# Altium schematic sheet Schema_linksonder.SchDoc
size A4; SheetNumber: 2; SheetTotal: 2
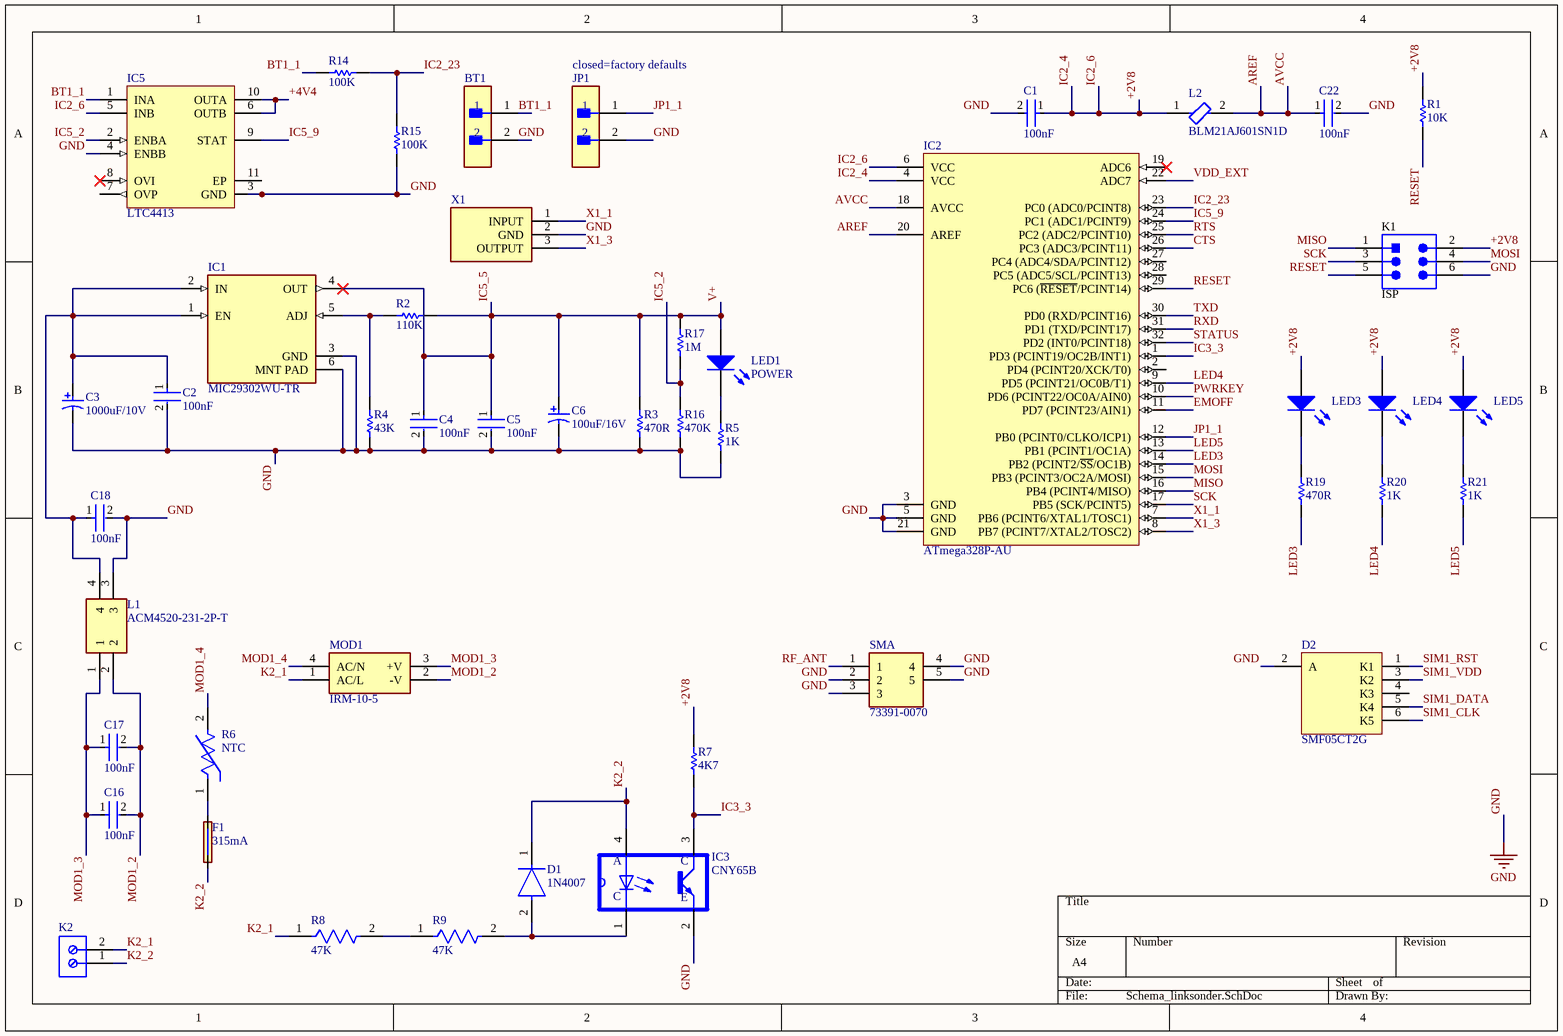
[diagram p0: Schema_linksonder.SchDoc]

## Parts
BT1  (no value)  [FP-M20-9990246-MFG]
C1  100nF  [FP-CC1206-1_25-MFG]
C2  100nF  [FP-CC1206-1_25-MFG]
C3  1000uF/10V  [NIC-CAPA2-10X10_V]
C4  100nF  [FP-CC1206-1_25-MFG]
C5  100nF  [FP-CC1206-1_25-MFG]
C6  100uF/16V  [AVX-TAJ-C-2_M]
C16  100nF  [FP-CC1206-1_25-MFG]
C17  100nF  [FP-CC1206-1_25-MFG]
C18  100nF  [FP-CC1206-1_25-MFG]
C22  100nF  [FP-CC1206-1_25-MFG]
D1  1N4007  [FP-1N4007-MFG]
D2  SMF05CT2G  [ONSC-SC70-6-419B-02_W_V]
F1  315mA  [MC000827]
IC1  MIC29302WU-TR  [FP-C04-012-MFG]
IC2  ATmega328P-AU  [32A_M]
IC3  CNY65B  [DIP762W50P1524L1780H610Q4]
IC5  LTC4413  [LT-DD-10_V]
JP1  closed=factory defaults  [FP-M20-9990246-MFG]
K1  ISP  [SMTC-TSW-103-08-L-D_V]
K2  (no value)  [PHOE-1714955_V]
L1  ACM4520-231-2P-T  [ACM4520]
L2  BLM21AJ601SN1D  [FP-BLM21-0_2-t0_85-e0_5-MFG]
LED1  POWER  [1206_A]
LED3  (no value)  [1206_A]
LED4  (no value)  [1206_A]
LED5  (no value)  [1206_A]
MOD1  IRM-10-5  [IRM-10]
R1  10K  [RESC3225X70X50NL20T20]
R2  110K  [RESC3225X70X50NL20T20]
R3  470R  [RESC3225X70X50NL20T20]
R4  43K  [RESC3225X70X50NL20T20]
R5  1K  [RESC3225X70X50NL20T20]
R6  NTC  [FP-NTPAA-MFG]
R7  4K7  [RESC3225X70X50NL20T20]
R8  47K  [FP-MRS25-MFG]
R9  47K  [FP-MRS25-MFG]
R14  100K  [RESC3225X70X50NL20T20]
R15  100K  [RESC3225X70X50NL20T20]
R16  470K  [RESC3225X70X50NL20T20]
R17  1M  [RESC3225X70X50NL20T20]
R19  470R  [RESC3225X70X50NL20T20]
R20  1K  [RESC3225X70X50NL20T20]
R21  1K  [RESC3225X70X50NL20T20]
SMA  73391-0070  [733910070]
X1  (no value)  [CSTCC8M00G53R0]

## Nets
GND: BT1.2 C1.2 C2.2 C3.2 C4.2 C5.2 C6.2 C18.2 C22.2 D2.2(A) IC1.3(GND) IC1.6(MNT_PAD) IC2.3(GND) IC2.5(GND) IC2.21(GND) IC3.2(E) IC5.3(GND) IC5.4(ENBB) JP1.2 K1.6 L1.3 R3.1 R4.1 R5.1 R15.1 R16.1 SMA.2 SMA.3 SMA.4 SMA.5 X1.2(GND)
+2V8: C1.1 IC2.4(VCC) IC2.6(VCC) IC5.5(INB) K1.2 L2.1 LED3.2(A) LED4.2(A) LED5.2(A) R1.2 R7.2  [also labelled IC2_4, IC2_6]
+4V4: IC5.6(OUTB) IC5.10(OUTA)
AREF: C22.1 IC2.18(AVCC) IC2.20(AREF) L2.2  [also labelled AVCC]
BT1_1: BT1.1 IC5.1(INA) R14.1
CTS: IC2.26(PC3_(ADC3/PCINT11))
EMOFF: IC2.11(PD7_(PCINT23/AIN1))
IC2_23: IC2.23(PC0_(ADC0/PCINT8)) R14.2 R15.2
IC3_3: IC2.1(PD3_(PCINT19/OC2B/INT1)) IC3.3(C`) R7.1
IC5_2: IC5.2(ENBA) R16.2 R17.1
IC5_5: C4.1 C5.1 C6.1 IC1.4(OUT) LED1.2(A) R2.1 R3.2 R17.2  [also labelled V+]
IC5_9: IC2.24(PC1_(ADC1/PCINT9)) IC5.9(STAT)
JP1_1: IC2.12(PB0_(PCINT0/CLKO/ICP1)) JP1.1
K2_1: K2.2 MOD1.1(AC/L) R8.1
K2_2: D1.1(C) F1.P$2 IC3.4(A) K2.1
LED3: IC2.14(PB2_(PCINT2/~{SS}/OC1B)) R19.1
LED4: IC2.9(PD5_(PCINT21/OC0B/T1)) R20.1
LED5: IC2.13(PB1_(PCINT1/OC1A)) R21.1
MISO: IC2.16(PB4_(PCINT4/MISO)) K1.1
MOD1_2: C16.2 C17.2 L1.2 MOD1.2(-V)
MOD1_3: C16.1 C17.1 L1.1 MOD1.3(+V)
MOD1_4: MOD1.4(AC/N) R6.2
MOSI: IC2.15(PB3_(PCINT3/OC2A/MOSI)) K1.4
PWRKEY: IC2.10(PD6_(PCINT22/OC0A/AIN0))
RESET: IC2.29(PC6_(~{RESET}/PCINT14)) K1.5 R1.1
RF_ANT: SMA.1
RTS: IC2.25(PC2_(ADC2/PCINT10))
RXD: IC2.31(PD1_(TXD/PCINT17))
SCK: IC2.17(PB5_(SCK/PCINT5)) K1.3
SIM1_CLK: D2.6(K5)
SIM1_DATA: D2.5(K4)
SIM1_RST: D2.1(K1)
SIM1_VDD: D2.3(K2)
STATUS: IC2.32(PD2_(INT0/PCINT18))
TXD: IC2.30(PD0_(RXD/PCINT16))
VDD_EXT: IC2.22(ADC7)
X1_1: IC2.7(PB6_(PCINT6/XTAL1/TOSC1)) X1.1(INPUT)
X1_3: IC2.8(PB7_(PCINT7/XTAL2/TOSC2)) X1.3(OUTPUT)
NetC2_1: C2.1 C3.1 C18.1 IC1.1(EN) IC1.2(IN) L1.4
NetD1_2: D1.2(A) IC3.1(C) R9.2
NetF1_P$1: F1.P$1 R6.1
NetIC1_5: IC1.5(ADJ) R2.2 R4.2
NetLED1_1: LED1.1(K) R5.2
NetLED3_1: LED3.1(K) R19.2
NetLED4_1: LED4.1(K) R20.2
NetLED5_1: LED5.1(K) R21.2
NetR8_2: R8.2 R9.1

Not connected (* = marked no-connect by the designer): D2 4(K3); IC2 2(PD4_(PCINT20/XCK/T0)) 19(ADC6)* 27(PC4_(ADC4/SDA/PCINT12)) 28(PC5_(ADC5/SCL/PCINT13)); IC5 7(OVP) 8(OVI)* 11(EP)

## Library data of the parts
BT1 JP1 = CMP-15831-000009-1: CONN HEADER VERT 2POS 2.54MM; Manufacturer: Harwin; Manufacturer Part Number: M20-9990246; Conn Gender: Male; Conn Orientation: Vertical; Number Of Contacts: 2; Current Rating: 3A; ComponentLink2URL: https://cdn.harwin.com/pdfs/M20-999.pdf; ComponentLink2Description: Datasheet; Package: M20-9990246; Temperature: -40°C to +105°C; Octopart: https://octopart.com/m20-9990246-harwin-2590635; Mouser Description: 2.54mm (0.1") Pitch SIL Vertical PC Tail Pin Header, 6.1mm mating pin height, tin, 2 contacts; Temperature Range High: +105°C; Device Class L1: Connectors; RoHS: TRUE; Automotive: No; Height: 8.99mm; Number Of Rows: 1; Contact Material: Tin,Nickel; Category: Conn; Pitch: 2.54mm; Lead Free: Yes; Digikey Description: CONN HEADER VERT 2POS 2.54MM; Temperature Range Low: -40°C; Device Class L3: unset; Device Class L2: Headers and Wire Housings
C1 C2 C4 C5 C16-C18 C22 = CMP-03422-000842-1: CAP CER 0.1UF 50V X7R 1206; Manufacturer: Yageo; Manufacturer Part Number: CC1206KRX7R9BB104; Automotive Grade: NA; Tolerance: 0.1; Material: Ceramic; Temperature Coefficient: 15%; Temperature Characteristic: X7R; Device Class L1: Passive Components; Lead Free: Yes; Octopart: https://octopart.com/cc1206krx7r9bb104-yageo-39467816; Category: Cap; Value: 100 nF; Temperature Range Low: -55°C; Device Class L3: Ceramic Capacitors; Voltage Rating: 50 V; Temperature Range High: +125°C; Device Class L2: Capacitors; RoHS: TRUE; Package: CC1206-1.25; Footprint Url: http://www.yageo.com/exep/pages/download/literatures/UPY-C_GEN_24.pdf; ComponentLink2Description: Datasheet; Temperature: -55°C to +125°C; Capacitance: 100 nF; Digikey Description: CAP CER 0.1UF 50V X7R 1206; Height: 1.45mm; Automotive: No; Mouser Description: Multilayer Ceramic Capacitors MLCC - SMD/SMT 100nF 50V X7R 10%; ComponentLink2URL: http://www.yageo.com/documents/recent/UPY-NP0X7R_HV_1KV-to-3KV_11.pdf
C3 = CMP-0687-00006-1: Aluminum Electrolytic Capacitor, UD Series, Low Impedance, 1000 uF, 10 V, + / - 20%, -55 to 105 degC, Chip Type, 10 x 10 mm D x L, Pb-Free, Reel; Manufacturer: Nichicon; PartNumber: UUD1A102MNL1GS; Rated Voltage: 10 V; Rated Capacitance: 1000 uF; Endurance Time: 5000 h; Impedance: 0.09 Ohm; Packing: Dia382mm Reel; Tolerance Rated Capacitance: -20 to 20%; Rated Ripple Current (at 100kHz): 670 mA; DatasheetVersion: 08/2012; PackageReference: CAPAE-D10H10; PackageDescription: 2-Pin Surface Mount Device, Diameter 10 mm, Height 10 mm, Pitch 8 mm; ComponentLink3URL: http://products.nichicon.co.jp/en/pdf/XJA043/e-ud.pdf; ComponentLink2Description: Datasheet; Diameter: 10 mm; ComponentLink1Description: Manufacturer URL; RoHS: TRUE; ComponentLink2URL: http://products.nichicon.co.jp/en/pdf/XJA043/e-ud.pdf; Length: 10 mm; ComponentLink1URL: http://www.nichicon.co.jp/; Mounting Technology: Surface Mount; ComponentLink3Description: Package Specification
C6 = CMP-2100-03691-1: Standard Tantalum, 100 uF, +/- 10%, 16 V, -55 to 125 degC, 2-Pin SMD (2312), RoHS, Tape and Reel; Manufacturer: AVX; Resistance: 1Ohm; Dissipation Factor: 8%; Voltage Rating: 16V; Polarity: Polar; Capacitance: 100uF; Leakage Current: 16uA; Datasheet URL: http://datasheets.avx.com/TAJ.pdf; Package Description: 2-Pin Surface Mount Device, Body 6 x 3.25 mm; Case/Package: Molded; Case Code (Metric): 6032; Number of Pins: 2; Tolerance: 10%; Length: 6mm; Width: 3.2mm; Height: 2.8mm; Height - Seated (Max): 0.11inch; Min Operating Temperature: -55degC; Termination: SMD/SMT; Voltage Rating (DC): 16V; Max Operating Temperature: 125degC; Package Quantity: 1; Manufacturer URL: http://www.avx.com/; RoHSCompliant: True; ESR (Equivalent Series Resistance): 1Ohm; Packaging: TapeandReel; Radiation Hardening: No; Lead Free: LeadFree; Case Code (Imperial): 2412; Depth: 3.2mm; Datasheet Version: 42401.0; Package Reference: TAJ-C-2; REACH SVHC: NoSVHC
D1 = CMP-02540-000046-1: DIODE GEN PURP 1KV 1A DO204AL; Manufacturer: Vishay; Manufacturer Part Number: 1N4007-E3/54; Value: 15pF; Max Junction Temp: +150°C; Max Surge Forward Current: 30A; Max Repetitive Reverse Voltage: 1000V; Peak Reverse Current: 30uA; Octopart: https://octopart.com/1n4007-e3%2F54-vishay-39548207; Digikey Description: DIODE GEN PURP 1KV 1A DO204AL; Category: Diode; Mouser Description: Rectifiers Vr/1000V Io/1A; Automotive: No; Package: 1N4007; Device Class L3: Rectifier Diodes; Temperature Range High: +150°C; Capacitance: 15pF; Ipc Land Pattern Name: DIOPA1088W105L520D270; Lead Free: Yes; ComponentLink2Description: Datasheet; Forward Current: 1A; Device Class L1: Discrete Semiconductors; ComponentLink2URL: http://www.vishay.com/docs/88503/1n4001.pdf; Temperature Range Low: -50°C; Height: 2.7mm; RoHS: TRUE; Temperature: -50°C to +150°C; Device Class L2: Diodes
D2 = CMP-1061-00157-1: 5-Line Transient Voltage Suppressor Array, 6-Pin SC70, Pb-Free, Tape and Reel; Manufacturer: On Semiconductor; PPK Max (W): 100; IR Max (uA): 5; Direction: Unidirectional; RoHS: Pb-Free; ComponentLink2URL: http://www.onsemi.com/pub_link/Collateral/SMF05C-D.PDF; DatasheetVersion: Rev. 4; PackageVersion: Rev. W; PackageReference: SC70-6-419B-02_W; PartNumber: SMF05CT2G; PackageDescription: 6-Pin Small Outline Transistor, Body 2 x 1.25 mm, Pitch 0.65 mm; Mounting Technology: Surface Mount; ComponentLink3URL: http://www.onsemi.com/pub_link/Collateral/SMF05C-D.PDF; ComponentLink2Description: Datasheet; ComponentLink3Description: Package Specification; Packing: Tape and Reel; ComponentLink1Description: Manufacturer URL; ComponentLink1URL: http://www.onsemi.com/
F1 = MC000827: Fuse Holder, 250 V, 6.3 A, Pcb Fuse Holder, Through Hole, 1; MF: Multicomp; Check_prices: https://www.snapeda.com/parts/MC000827/Multicomp/view-part/2895630/?ref=eda; Availability: Unavailable; Price: None; SnapEDA_Link: https://www.snapeda.com/parts/MC000827/Multicomp/view-part/2895630/?ref=snap; Package: None; Value: *; MP: MC000827
IC1 = CMP-06324-000007-1: IC REG LINEAR POS ADJ 3A TO263-5; Manufacturer: Microchip; Output Voltage: 3.3-12V; Output Type: AdjustableProgrammable; Max Junction Temp: +125°C; Standoff Height: 0mm; Accuracy Percentage: 1%; Max Supply Voltage: 26V; Nominal Supply Current: 10-37mA; Number Of Outputs: 1; Dropout Voltage: 370mV; Min Supply Voltage: 2.25V; ComponentLink2URL: http://ww1.microchip.com/downloads/en/DeviceDoc/MIC2915x-30x-50x-75x-High-Current-Low-Dropout-Regulators-DS20005685B.pdf; Device Class L1: Integrated Circuits (ICs); Digikey Description: IC REG LINEAR POS ADJ 3A TO263-5; Device Class L2: Power Management ICs; Lead Free: Yes; Mouser Description: LDO Voltage Regulators; Package: C04-012; Temperature: -40°C to +125°C; ComponentLink2Description: Datasheet; Temperature Range High: +125°C; Automotive: No; Device Class L3: Voltage Regulators - Linear; Category: IC; Temperature Range Low: -40°C; RoHS: TRUE; Output Current: 3A; Octopart: https://octopart.com/mic29302wu-tr-microchip-66801318; Manufacturer Part Number: MIC29302WU-TR; Height: 0.2inch
IC2 = CMP-0095-00269-2: 8-bit AVR Microcontroller, 32KB Flash, 1KB EEPROM, 2KB SRAM, 32-pin TQFP, Industrial Grade (-40°C to 85°C); PackageDescription: 32-Lead, 7x7x1.0 mm Body, 0.8mm Lead Pitch, Thin Profile Plastic Quad Flat Package (TQFP); DatasheetVersion: revD, May-2011; RevisionNote: DatasheetVersion & PackageVersion updated. URLs added.; ComponentLink1URL: http://www.atmel.com/; ComponentLink2Description: ATmega48A/48PA/88A/88PA/168A/168PA/328/328P Datasheet; Code_JEDEC: MS-026-ABA; ComponentLink1Description: Manufacturer URL; PackageReference: 32A; ComponentLink3Description: ATmega48A/48PA/88A/88PA/168A/168PA/328/328P Summary; ComponentLink2URL: http://www.atmel.com/dyn/resources/prod_documents/doc8271.pdf; PackageVersion: revC, Oct-2010; ComponentLink3URL: http://www.atmel.com/dyn/resources/prod_documents/8271S.pdf
IC5 = CMP-0479-00026-1: Dual 2.6 A, Fast Ideal Diode, Overvoltage Protection Sensor with Drive Output for An External P-Channel MOSFET, 2.6 to 5.5 V Vin, 10-pin SON (DD-10), -40 to 85 degC, Pb-Free; Manufacturer: Linear Technology; PartNumber: LTC4413EDD-2#PBF; Ideal Diode: Dual, Internal, P-Channel; Code_JEDEC: MO-229; ComponentLink2Description: Datasheet; ComponentLink1Description: Manufacturer URL; PackageReference: DD-10; Mounting Technology: Surface Mount; DatasheetVersion: Rev. D; PackageVersion: Rev. C, 06/2010; ComponentLink2URL: http://cds.linear.com/docs/en/datasheet/441312fd.pdf; ComponentLink3URL: http://cds.linear.com/docs/en/packaging/DFN_10_05-08-1699.pdf; PackageDescription: 10-Pin Plastic DFN, Body 3 x 3 mm, Pitch 0.5 mm; RoHS: TRUE; ComponentLink1URL: http://www.linear.com/; ComponentLink3Description: Package Specification
K1 = CMP-1024-00336-5: Male Header, Pitch 2.54 mm, 2 x 3 Position, Height 8.38 mm, Tail Length 5.08 mm, -55 to 125 degC, RoHS, Bulk; Manufacturer: Samtec; DatasheetVersion: 04/2012; ComponentLink3URL: http://suddendocs.samtec.com/prints/tsw-xxx-xx-x-x-xx-xxx-footprint.pdf; PackageReference: TSW-103-08-L-D; Mounting Technology: Through Hole; Min Operating Temperature: -55 degC; ComponentLink2Description: Datasheet; Lead Pitch: 2.54 mm; ComponentLink1Description: Manufacturer URL; Mount: Through Hole; ComponentLink1URL: http://www.samtec.com/; ComponentLink3Description: Package Specification; Max Operating Temperature: 125 degC; PackageDescription: Male Header, Pitch 2.54 mm, 2 x 3 Position, Height 8.38 mm, Tail Length 5.08 mm; ComponentLink2URL: https://datasheet.ciiva.com/25618/0900766b81154476-25618436.pdf; RoHSCompliant: true
K2 = CMP-2000-05797-1: PC Terminal Block, Pitch 6.35 mm, 1 x 2 Position, Height 21.5 mm, Tail Lenght 5.1 mm, RoHS, Bulk; Manufacturer: Phoenix Contact; Package Description: PC Terminal Block, Pitch 6.35 mm, 1 x 2 Position, Height 21.5 mm, Tail Lenght 5.1 mm; Datasheet URL: http://media.digikey.com/pdf/Data%20Sheets/Phoenix%20Contact%20PDFs/1714955.pdf; Package Reference: 1714955; Manufacturer URL: http://www.phoenixcontact.com/; Datasheet Version: 02/2010; Mounting Technology: ThroughHole
L1 = ACM4520-231-2P-T000: Filter; Manufacturer_Name: TDK; Datasheet Link: http://uk.rs-online.com/web/p/products/9164134P; RS Part Number: 9164134P; RS Price/Stock: http://uk.rs-online.com/web/p/products/9164134P; Manufacturer_Part_Number: ACM4520-231-2P-T000
L2 = CMP-0686-00622-4: Chip Ferrite Bead, 0805, 22Ω @ 100MHz, 0.009Ω, 25%, 6A; Manufacturer Series: BLM21P; Resistance: 10mR; DC Resistance-Max: 9mR; Material: Steel; Number of Circuits: 1; Impedance: 22R; Shielding: Unshielded; DC Current: 6A; Termination: SMD/SMT; Max Operating Temperature: 125°C; Case Code (Metric): 2012; Radiation Hardening: No; Length: 2mm; Case Code (Imperial): 0805; RoHS Compliant: Yes; Max Current Rating: 6A; DC Resistance (DCR): 9mR; Case/Package: 0805; Core Material: Ferrite; Width: 1.25mm; Weight: 0.000194oz; Number of Pins: 2; Packaging: Tape and Reel; REACH SVHC: No SVHC; Tolerance: 25%; Height: 0.85mm; Number of Functions: 1; Lead Free: Lead Free; Terminal Finish: Tin; Number of Lines: 1; Package Quantity: 1; Series: BLM21P; Test Frequency: 100MHz; Min Operating Temperature: -55°C; Max DC Current: 6A; Current Rating: 6A; Depth: 1.25mm
LED1 = CMP-1426-00019-1: SMD mono-color Chip LED, WL-SMCW, Yellow; PartNumber: 150120YS75000; Manufacturer: Wuerth Elektronik; ComponentLink2URL: http://katalog.we-online.com/led/datasheet/150120YS75000.pdf; ComponentLink1URL: http://www.we-online.com; Color: Yellow; ComponentLink1Description: Manufacturer URL; PackageReference: 1206_A; ComponentLink2Description: Datasheet
LED3-LED5 = CMP-1426-00014-1: SMD mono-color Chip LED, WL-SMCW, Green; Manufacturer: Wuerth Elektronik; PartNumber: 150120GS75000; PackageReference: 1206_A; ComponentLink1Description: Manufacturer URL; ComponentLink2URL: http://katalog.we-online.com/led/datasheet/150120GS75000.pdf; ComponentLink2Description: Datasheet; Color: Green; ComponentLink1URL: http://www.we-online.com
MOD1 = IRM-10-5: Power Supply; Manufacturer_Name: Mean Well; Datasheet Link: https://www.meanwell-web.com/en/download_datasheet.php?products_id=IRM-10-5&type=3; Manufacturer_Part_Number: IRM-10-5; Mouser Part Number: 709-IRM10-5; Mouser Price/Stock: https://www.mouser.co.uk/ProductDetail/MEAN-WELL/IRM-10-5?qs=WkdRfq4wf1Mbq1AdfDJBoQ%3D%3D; Arrow Part Number: IRM-10-5; Arrow Price/Stock: https://www.arrow.com/en/products/irm-10-5/mean-well-enterprises
R1-R5 R7 R14-R17 R19-R21 = CMP-2005-03795-1: Manufacturer: Panasonic; Part Number: ERJ14BQF3R3U
R6 = CMP-06022-000035-1: ICL 5.1 OHM 15% 2.5A 10MM; Lead Diameter: 0.8mm; Resistance: 5.1R; Voltage: 264V; Case/Package: Radial; Width: 5mm; Package Quantity: 100; Current Rating: 2.5A; Depth: 5mm; Lead Pitch: 0.295inch; Packaging: Bulk; Tolerance: 15%; Min Operating Temperature: -20°C; Mount: Through Hole; Lead Free: Lead Free; Diameter: 0.394inch; Thickness: 5mm; Number of Pins: 2; Radiation Hardening: No; Max Operating Temperature: 160°C
R8 R9 = CMP-02408-000003-1: RES 1.1K OHM 0.6W 1% AXIAL; Manufacturer: Vishay BC Components; Manufacturer Part Number: MRS25000C1101FCT00; Voltage Rating: 350V; Resistance: 1.1kΩ; Temperature Coefficient: 50ppm/°C; Value: 1.1kΩ; Device Class L1: Passive Components; Height: 2.5mm; Octopart: https://octopart.com/mrs25000c1101fct00-vishay-43740214; Temperature Range Low: -55°C; Temperature: -55°C to +155°C; Temperature Range High: +155°C; Lead Free: Yes; Mouser Description: Thin Film Resistors .6watt 1.1Kohms 1%; Power Rating: 0.6W; Digikey Description: RES 1.1K OHM 0.6W 1% AXIAL; RoHS: TRUE; Tolerance: 1%; Package: MRS25; Device Class L3: Through-Hole Resistors; ComponentLink2URL: http://www.vishay.com/docs/28724/mrs16m25.pdf; ComponentLink2Description: Datasheet; Composition: Thin Film; Automotive: No; Ipc Land Pattern Name: RESAD1000W75L650D250; Device Class L2: Resistors; Category: Res; Series: MRS25
SMA = 73391-0070: Connector; Manufacturer_Name: Molex; Datasheet Link: https://www.mouser.com/datasheet/2/276/0733910070_RF_COAX_CONNECTORS-173128.pdf; Height: 10mm; Manufacturer_Part_Number: 73391-0070; Mouser Part Number: 538-73391-0070; Mouser Price/Stock: https://www.mouser.co.uk/ProductDetail/Molex/73391-0070?qs=Vtbn2VVmZzEJo591qvlOmw%3D%3D
X1 = CSTCC8M00G53-R0: Crystal or Oscillator; Manufacturer_Name: Murata Electronics; Datasheet Link: https://static6.arrow.com/aropdfconversion/88614e16d89192a4753a3252faaa6ecdd300b683/36382473867110040p16e_auto.pdf; Height: 1.6mm; Manufacturer_Part_Number: CSTCC8M00G53-R0; Mouser Part Number: 81-CSTCC8.00MG-TC; Mouser Price/Stock: https://www.mouser.co.uk/ProductDetail/Murata-Electronics/CSTCC8M00G53-R0?qs=hDePDv5mxMFOvJFSEOl81A%3D%3D; Arrow Part Number: CSTCC8M00G53-R0; Arrow Price/Stock: https://www.arrow.com/en/products/cstcc8m00g53-r0/murata-manufacturing
IC3 = CNY65B: Package: None; Price: None; Value: *; MP: CNY65B; Availability: Unavailable